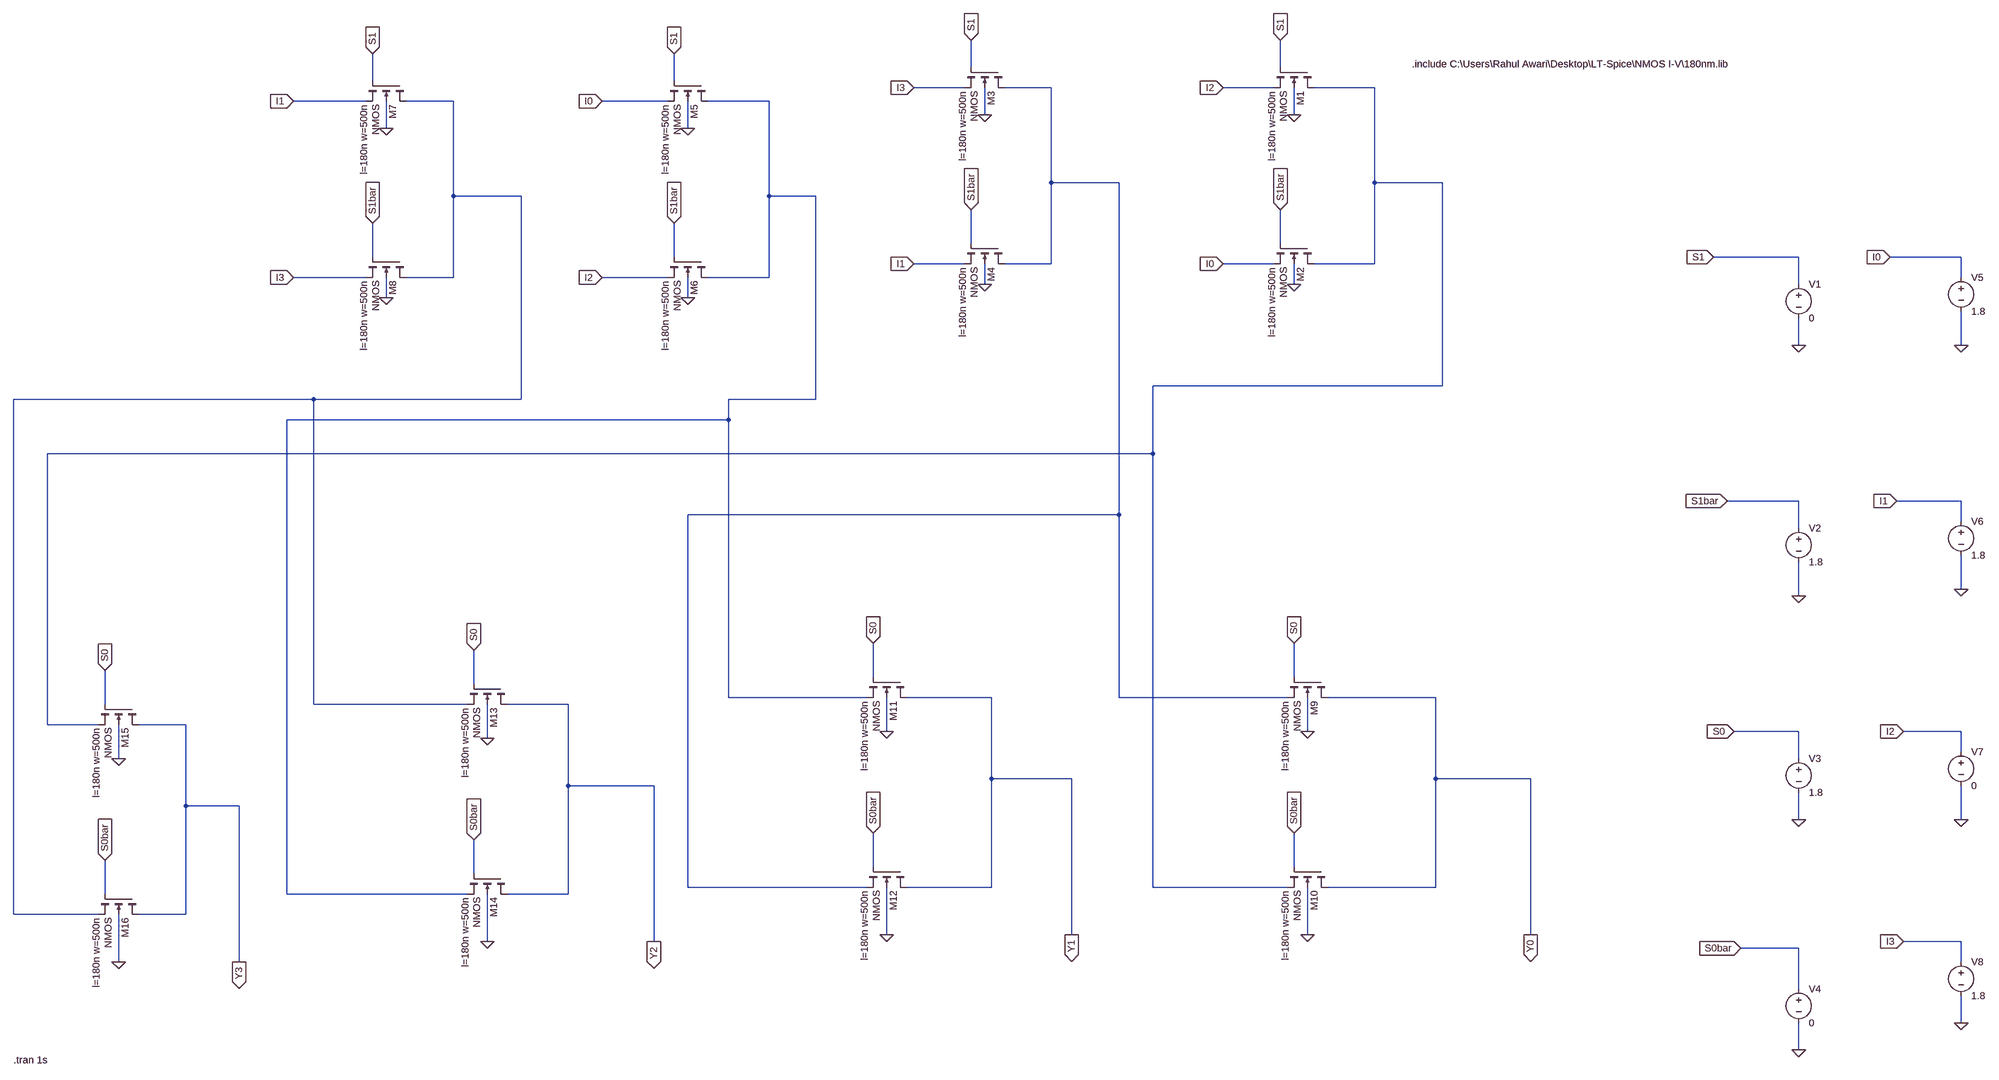
[diagram p0: schematic DA1.asc]
DA1.asc, the LTspice schematic file:
Version 4
SHEET 1 2512 2424
WIRE -592 64 -592 0
WIRE 288 64 288 0
WIRE -2288 96 -2288 32
WIRE -1408 96 -1408 32
WIRE -608 112 -784 112
WIRE -368 112 -512 112
WIRE 272 112 96 112
WIRE 512 112 368 112
WIRE -2304 144 -2480 144
WIRE -2064 144 -2208 144
WIRE -1424 144 -1600 144
WIRE -1184 144 -1328 144
WIRE -560 176 -560 112
WIRE 320 176 320 112
WIRE -2256 208 -2256 144
WIRE -1376 208 -1376 144
WIRE -368 336 -368 112
WIRE -208 336 -368 336
WIRE 512 336 512 112
WIRE 672 336 512 336
WIRE -2064 368 -2064 144
WIRE -1904 368 -2064 368
WIRE -1184 368 -1184 144
WIRE -1024 368 -1184 368
WIRE -592 480 -592 400
WIRE 288 480 288 400
WIRE -2288 512 -2288 432
WIRE -1408 512 -1408 432
WIRE 1568 512 1312 512
WIRE 2448 512 2160 512
WIRE -608 528 -784 528
WIRE -368 528 -368 336
WIRE -368 528 -512 528
WIRE 272 528 96 528
WIRE 512 528 512 336
WIRE 512 528 368 528
WIRE -2304 560 -2480 560
WIRE -2064 560 -2064 368
WIRE -2064 560 -2208 560
WIRE -1424 560 -1600 560
WIRE -1184 560 -1184 368
WIRE -1184 560 -1328 560
WIRE 2448 560 2448 512
WIRE -560 576 -560 528
WIRE 320 576 320 528
WIRE 1568 576 1568 512
WIRE -2256 608 -2256 560
WIRE -1376 608 -1376 560
WIRE 1568 720 1568 656
WIRE 2448 720 2448 640
WIRE 672 816 672 336
WIRE 672 816 -128 816
WIRE -2432 848 -3664 848
WIRE -1904 848 -1904 368
WIRE -1904 848 -2432 848
WIRE -1024 848 -1024 368
WIRE -1024 848 -1280 848
WIRE -1280 896 -1280 848
WIRE -1280 896 -2496 896
WIRE -128 976 -128 816
WIRE -128 976 -3584 976
WIRE 1568 1088 1344 1088
WIRE 2448 1088 2176 1088
WIRE -208 1120 -208 336
WIRE -208 1120 -1376 1120
WIRE 2448 1136 2448 1088
WIRE 1568 1152 1568 1088
WIRE 2448 1296 2448 1216
WIRE 1568 1312 1568 1232
WIRE -880 1504 -880 1424
WIRE 320 1504 320 1424
WIRE -2016 1520 -2016 1440
WIRE -1280 1552 -1280 896
WIRE -896 1552 -1280 1552
WIRE -544 1552 -800 1552
WIRE -208 1552 -208 1120
WIRE 304 1552 -208 1552
WIRE 656 1552 400 1552
WIRE -3168 1568 -3168 1488
WIRE -2432 1568 -2432 848
WIRE -2032 1568 -2432 1568
WIRE -1680 1568 -1936 1568
WIRE -3584 1616 -3584 976
WIRE -3184 1616 -3584 1616
WIRE -2832 1616 -3088 1616
WIRE -848 1632 -848 1552
WIRE 352 1632 352 1552
WIRE 1568 1632 1360 1632
WIRE 2448 1632 2192 1632
WIRE -1984 1648 -1984 1568
WIRE 2448 1680 2448 1632
WIRE -3136 1696 -3136 1616
WIRE 1568 1696 1568 1632
WIRE -544 1744 -544 1552
WIRE -320 1744 -544 1744
WIRE 656 1744 656 1552
WIRE 880 1744 656 1744
WIRE -1680 1760 -1680 1568
WIRE -1456 1760 -1680 1760
WIRE -2832 1808 -2832 1616
WIRE -2608 1808 -2832 1808
WIRE 1568 1840 1568 1776
WIRE 2448 1840 2448 1760
WIRE -880 1952 -880 1872
WIRE 320 1952 320 1872
WIRE -2016 1968 -2016 1888
WIRE -1376 2000 -1376 1120
WIRE -896 2000 -1376 2000
WIRE -544 2000 -544 1744
WIRE -544 2000 -800 2000
WIRE -128 2000 -128 976
WIRE 304 2000 -128 2000
WIRE 656 2000 656 1744
WIRE 656 2000 400 2000
WIRE -3168 2016 -3168 1936
WIRE -2496 2016 -2496 896
WIRE -2032 2016 -2496 2016
WIRE -1680 2016 -1680 1760
WIRE -1680 2016 -1936 2016
WIRE -3664 2064 -3664 848
WIRE -3184 2064 -3664 2064
WIRE -2832 2064 -2832 1808
WIRE -2832 2064 -3088 2064
WIRE -848 2112 -848 2000
WIRE -320 2112 -320 1744
WIRE 352 2112 352 2000
WIRE 880 2112 880 1744
WIRE -1984 2128 -1984 2016
WIRE -1456 2128 -1456 1760
WIRE 2448 2128 2192 2128
WIRE 1568 2144 1376 2144
WIRE -3136 2176 -3136 2064
WIRE -2608 2176 -2608 1808
WIRE 2448 2176 2448 2128
WIRE 1568 2240 1568 2144
WIRE 2448 2320 2448 2256
WIRE 1568 2384 1568 2320
FLAG 320 176 0
FLAG 320 576 0
FLAG 288 0 S1
IOPIN 288 0 In
FLAG 288 400 S1bar
IOPIN 288 400 In
FLAG 96 528 I0
IOPIN 96 528 In
FLAG 96 112 I2
IOPIN 96 112 In
FLAG -560 176 0
FLAG -560 576 0
FLAG -592 0 S1
IOPIN -592 0 In
FLAG -592 400 S1bar
IOPIN -592 400 In
FLAG -1376 208 0
FLAG -1376 608 0
FLAG -1408 32 S1
IOPIN -1408 32 In
FLAG -1408 432 S1bar
IOPIN -1408 432 In
FLAG -2256 208 0
FLAG -2256 608 0
FLAG -2288 32 S1
IOPIN -2288 32 In
FLAG -2288 432 S1bar
IOPIN -2288 432 In
FLAG -784 528 I1
IOPIN -784 528 In
FLAG -784 112 I3
IOPIN -784 112 In
FLAG -1600 560 I2
IOPIN -1600 560 In
FLAG -1600 144 I0
IOPIN -1600 144 In
FLAG -2480 560 I3
IOPIN -2480 560 In
FLAG -2480 144 I1
IOPIN -2480 144 In
FLAG 352 1632 0
FLAG 352 2112 0
FLAG 320 1424 S0
IOPIN 320 1424 In
FLAG 320 1872 S0bar
IOPIN 320 1872 In
FLAG -848 1632 0
FLAG -848 2112 0
FLAG -880 1424 S0
IOPIN -880 1424 In
FLAG -880 1872 S0bar
IOPIN -880 1872 In
FLAG -1984 1648 0
FLAG -1984 2128 0
FLAG -2016 1440 S0
IOPIN -2016 1440 In
FLAG -2016 1888 S0bar
IOPIN -2016 1888 In
FLAG -3136 1696 0
FLAG -3136 2176 0
FLAG -3168 1488 S0
IOPIN -3168 1488 In
FLAG -3168 1936 S0bar
IOPIN -3168 1936 In
FLAG -1456 2128 Y2
IOPIN -1456 2128 Out
FLAG 880 2112 Y0
IOPIN 880 2112 Out
FLAG -320 2112 Y1
IOPIN -320 2112 Out
FLAG -2608 2176 Y3
IOPIN -2608 2176 Out
FLAG 1312 512 S1
IOPIN 1312 512 In
FLAG 1344 1088 S1bar
IOPIN 1344 1088 In
FLAG 1360 1632 S0
IOPIN 1360 1632 In
FLAG 1376 2144 S0bar
IOPIN 1376 2144 In
FLAG 1568 720 0
FLAG 1568 1312 0
FLAG 1568 1840 0
FLAG 1568 2384 0
FLAG 2160 512 I0
IOPIN 2160 512 In
FLAG 2176 1088 I1
IOPIN 2176 1088 In
FLAG 2192 1632 I2
IOPIN 2192 1632 In
FLAG 2192 2128 I3
IOPIN 2192 2128 In
FLAG 2448 720 0
FLAG 2448 1296 0
FLAG 2448 1840 0
FLAG 2448 2320 0
SYMBOL nmos4 368 64 R90
WINDOW 123 56 100 Left 2
SYMATTR Value2 l=180n w=500n
SYMATTR InstName M1
SYMBOL nmos4 368 480 R90
WINDOW 123 56 100 Left 2
SYMATTR Value2 l=180n w=500n
SYMATTR InstName M2
SYMBOL nmos4 -512 64 R90
WINDOW 123 56 100 Left 2
SYMATTR Value2 l=180n w=500n
SYMATTR InstName M3
SYMBOL nmos4 -512 480 R90
WINDOW 123 56 100 Left 2
SYMATTR Value2 l=180n w=500n
SYMATTR InstName M4
SYMBOL nmos4 -1328 96 R90
WINDOW 123 56 100 Left 2
SYMATTR Value2 l=180n w=500n
SYMATTR InstName M5
SYMBOL nmos4 -1328 512 R90
WINDOW 123 56 100 Left 2
SYMATTR Value2 l=180n w=500n
SYMATTR InstName M6
SYMBOL nmos4 -2208 96 R90
WINDOW 123 56 100 Left 2
SYMATTR Value2 l=180n w=500n
SYMATTR InstName M7
SYMBOL nmos4 -2208 512 R90
WINDOW 123 56 100 Left 2
SYMATTR Value2 l=180n w=500n
SYMATTR InstName M8
SYMBOL nmos4 400 1504 R90
WINDOW 123 56 100 Left 2
SYMATTR Value2 l=180n w=500n
SYMATTR InstName M9
SYMBOL nmos4 400 1952 R90
WINDOW 123 56 100 Left 2
SYMATTR Value2 l=180n w=500n
SYMATTR InstName M10
SYMBOL nmos4 -800 1504 R90
WINDOW 123 56 100 Left 2
SYMATTR Value2 l=180n w=500n
SYMATTR InstName M11
SYMBOL nmos4 -800 1952 R90
WINDOW 123 56 100 Left 2
SYMATTR Value2 l=180n w=500n
SYMATTR InstName M12
SYMBOL nmos4 -1936 1520 R90
WINDOW 123 56 100 Left 2
SYMATTR Value2 l=180n w=500n
SYMATTR InstName M13
SYMBOL nmos4 -1936 1968 R90
WINDOW 123 56 100 Left 2
SYMATTR Value2 l=180n w=500n
SYMATTR InstName M14
SYMBOL nmos4 -3088 1568 R90
WINDOW 123 56 100 Left 2
SYMATTR Value2 l=180n w=500n
SYMATTR InstName M15
SYMBOL nmos4 -3088 2016 R90
WINDOW 123 56 100 Left 2
SYMATTR Value2 l=180n w=500n
SYMATTR InstName M16
SYMBOL voltage 1568 560 R0
WINDOW 123 0 0 Left 0
WINDOW 39 0 0 Left 0
SYMATTR InstName V1
SYMATTR Value 0
SYMBOL voltage 1568 1136 R0
WINDOW 123 0 0 Left 0
WINDOW 39 0 0 Left 0
SYMATTR InstName V2
SYMATTR Value 1.8
SYMBOL voltage 1568 1680 R0
WINDOW 123 0 0 Left 0
WINDOW 39 0 0 Left 0
SYMATTR InstName V3
SYMATTR Value 1.8
SYMBOL voltage 1568 2224 R0
WINDOW 123 0 0 Left 0
WINDOW 39 0 0 Left 0
SYMATTR InstName V4
SYMATTR Value 0
SYMBOL voltage 2448 544 R0
WINDOW 123 0 0 Left 0
WINDOW 39 0 0 Left 0
SYMATTR InstName V5
SYMATTR Value 1.8
SYMBOL voltage 2448 1120 R0
WINDOW 123 0 0 Left 0
WINDOW 39 0 0 Left 0
SYMATTR InstName V6
SYMATTR Value 1.8
SYMBOL voltage 2448 1664 R0
WINDOW 123 0 0 Left 0
WINDOW 39 0 0 Left 0
SYMATTR InstName V7
SYMATTR Value 0
SYMBOL voltage 2448 2160 R0
WINDOW 123 0 0 Left 0
WINDOW 39 0 0 Left 0
SYMATTR InstName V8
SYMATTR Value 1.8
TEXT 600 56 Left 2 !.include C:\\Users\\Rahul Awari\\Desktop\\LT-Spice\\NMOS I-V\\180nm.lib
TEXT -3664 2408 Left 2 !.tran 1s

The netlist it stands for:
* DA1.asc
M1 N002 S1 I2 0 NMOS l=180n w=500n
M2 N002 S1bar I0 0 NMOS l=180n w=500n
M3 N001 S1 I3 0 NMOS l=180n w=500n
M4 N001 S1bar I1 0 NMOS l=180n w=500n
M5 N004 S1 I0 0 NMOS l=180n w=500n
M6 N004 S1bar I2 0 NMOS l=180n w=500n
M7 N003 S1 I1 0 NMOS l=180n w=500n
M8 N003 S1bar I3 0 NMOS l=180n w=500n
M9 Y0 S0 N001 0 NMOS l=180n w=500n
M10 Y0 S0bar N002 0 NMOS l=180n w=500n
M11 Y1 S0 N004 0 NMOS l=180n w=500n
M12 Y1 S0bar N001 0 NMOS l=180n w=500n
M13 Y2 S0 N003 0 NMOS l=180n w=500n
M14 Y2 S0bar N004 0 NMOS l=180n w=500n
M15 Y3 S0 N002 0 NMOS l=180n w=500n
M16 Y3 S0bar N003 0 NMOS l=180n w=500n
V1 S1 0 0
V2 S1bar 0 1.8
V3 S0 0 1.8
V4 S0bar 0 0
V5 I0 0 1.8
V6 I1 0 1.8
V7 I2 0 0
V8 I3 0 1.8
.model NMOS NMOS
.model PMOS PMOS
.lib standard.mos
.include C:\Users\Rahul Awari\Desktop\LT-Spice\NMOS I-V\180nm.lib
.tran 1s
.backanno
.end